# EAGLE schematic Project (EAGLE 9.5.2)
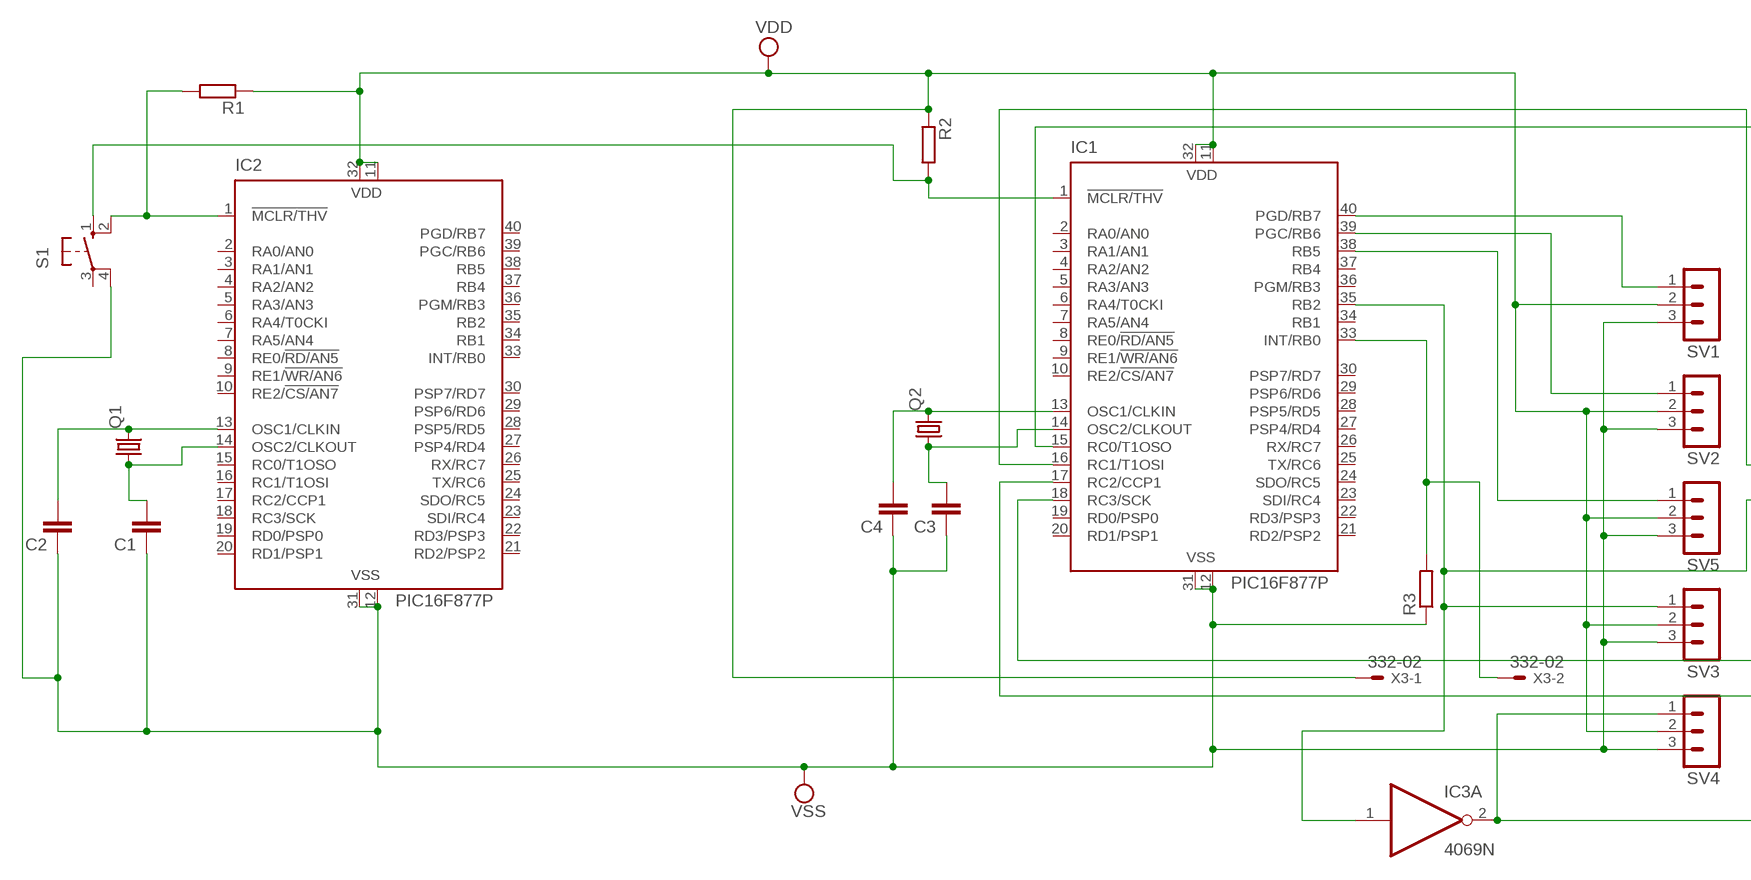
[diagram p0: schematic, sheet 1, part 1 of 2]
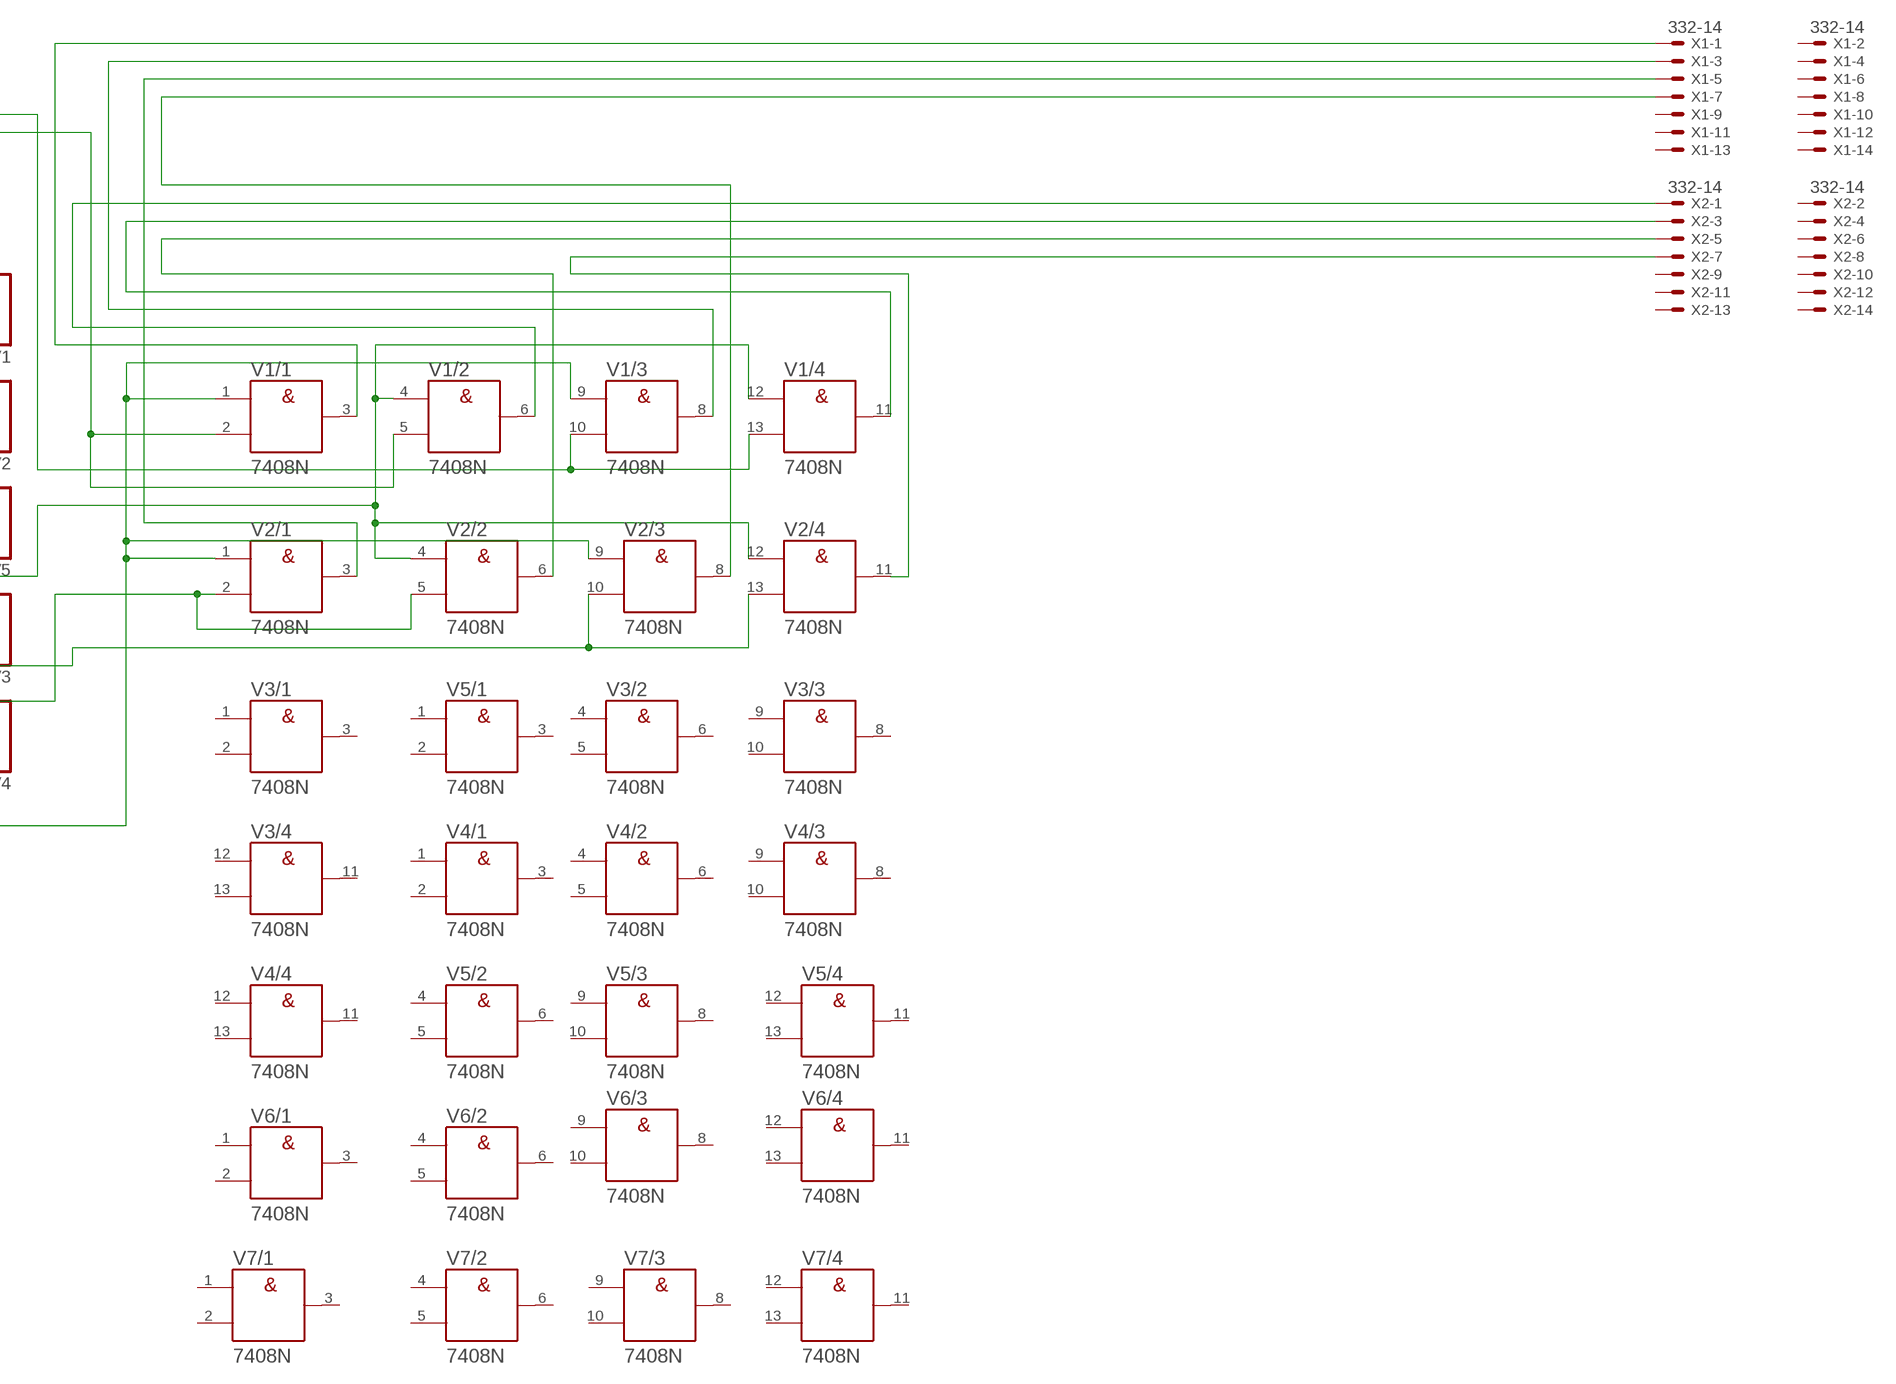
[diagram p1: schematic, sheet 1, part 2 of 2]

## Parts
C1  C7.5/3  [C7.5B3]
C2  C7.5/3  [C7.5B3]
C3  C7.5/3  [C7.5B3]
C4  C7.5/3  [C7.5B3]
IC1  PIC16F877P  [DIL40]
IC2  PIC16F877P  [DIL40]
IC3  4069N  [DIL14]
Q1  CRYSTALHC49U-V  [HC49U-V]
Q2  CRYSTALHC49U-V  [HC49U-V]
R1  R-EU_0207/10  [0207/10]
R2  R-EU_0207/10  [0207/10]
R3  R-EU_0207/10  [0207/10]
S1  10-XX  [B3F-10XX]
SV1  MA03-1  [MA03-1]
SV2  MA03-1  [MA03-1]
SV3  MA03-1  [MA03-1]
SV4  MA03-1  [MA03-1]
SV5  MA03-1  [MA03-1]
V1  7408N  [DIL14]
V2  7408N  [DIL14]
V3  7408N  [DIL14]
V4  7408N  [DIL14]
V5  7408N  [DIL14]
V6  7408N  [DIL14]
V7  7408N  [DIL14]
X1  332-14  [332-14]
X2  332-14  [332-14]
X3  332-02  [332-02]

## Nets
N$1: IC1.33(INT/RB0) R3.2 X3.2
N$2: IC1.35(RB2) IC3.1(A:I) SV3.1 V1.4(/2:A) V1.12(/4:A) V2.4(/2:A) V2.12(/4:A)
N$3: C4.2 IC1.13(OSC1/CLKIN) Q2.2
N$4: C3.2 IC1.14(OSC2/CLKOUT) Q2.1
N$5: C2.2 IC2.13(OSC1/CLKIN) Q1.2
N$6: C1.2 IC2.14(OSC2/CLKOUT) Q1.1
N$7: IC1.1(!MCLR/THV) R2.2 S1.1(S)
N$8: IC2.1(!MCLR/THV) R1.2 S1.2(S1)
N$9: IC1.38(RB5) SV5.1
N$10: IC1.39(PGC/RB6) SV2.1
N$11: IC1.40(PGD/RB7) SV1.1
N$12: IC3.2(A:O) SV4.1 V1.1(/1:A) V1.9(/3:A) V2.1(/1:A) V2.9(/3:A)
N$13: IC1.15(RC0/T1OSO) V1.2(/1:B) V1.5(/2:B)
N$14: V1.8(/3:Y) X1.3
N$15: V1.11(/4:Y) X2.3
N$16: V1.3(/1:Y) X1.1
N$17: V1.6(/2:Y) X2.1
N$18: IC1.16(RC1/T1OSI) V1.10(/3:B) V1.13(/4:B)
N$19: IC1.17(RC2/CCP1) V2.2(/1:B) V2.5(/2:B)
N$21: V2.3(/1:Y) X1.5
N$22: V2.6(/2:Y) X2.5
N$23: IC1.18(RC3/SCK) V2.10(/3:B) V2.13(/4:B)
N$24: V2.8(/3:Y) X1.7
N$25: V2.11(/4:Y) X2.7
VDD: IC1.11(VDD) IC1.32(VDD) IC2.11(VDD) IC2.32(VDD) R1.1 R2.1 SV1.2 SV2.2 SV3.2 SV4.2 SV5.2 X3.1
VSS: C1.1 C2.1 C3.1 C4.1 IC1.12(VSS) IC1.31(VSS) IC2.12(VSS) IC2.31(VSS) R3.1 S1.4(P1) SV1.3 SV2.3 SV3.3 SV4.3 SV5.3
Unconnected: IC1.2(RA0/AN0) IC1.3(RA1/AN1) IC1.4(RA2/AN2) IC1.5(RA3/AN3) IC1.6(RA4/T0CKI) IC1.7(RA5/AN4) IC1.8(RE0/!RD/AN5) IC1.9(RE1/!WR/AN6) IC1.10(RE2/!CS/AN7) IC1.19(RD0/PSP0) IC1.20(RD1/PSP1) IC1.21(RD2/PSP2) IC1.22(RD3/PSP3) IC1.23(SDI/RC4) IC1.24(SDO/RC5) IC1.25(TX/RC6) IC1.26(RX/RC7) IC1.27(PSP4/RD4) IC1.28(PSP5/RD5) IC1.29(PSP6/RD6) IC1.30(PSP7/RD7) IC1.34(RB1) IC1.36(PGM/RB3) IC1.37(RB4) IC2.2(RA0/AN0) IC2.3(RA1/AN1) IC2.4(RA2/AN2) IC2.5(RA3/AN3) IC2.6(RA4/T0CKI) IC2.7(RA5/AN4) IC2.8(RE0/!RD/AN5) IC2.9(RE1/!WR/AN6) IC2.10(RE2/!CS/AN7) IC2.15(RC0/T1OSO) IC2.16(RC1/T1OSI) IC2.17(RC2/CCP1) IC2.18(RC3/SCK) IC2.19(RD0/PSP0) IC2.20(RD1/PSP1) IC2.21(RD2/PSP2) IC2.22(RD3/PSP3) IC2.23(SDI/RC4) IC2.24(SDO/RC5) IC2.25(TX/RC6) IC2.26(RX/RC7) IC2.27(PSP4/RD4) IC2.28(PSP5/RD5) IC2.29(PSP6/RD6) IC2.30(PSP7/RD7) IC2.33(INT/RB0) IC2.34(RB1) IC2.35(RB2) IC2.36(PGM/RB3) IC2.37(RB4) IC2.38(RB5) IC2.39(PGC/RB6) IC2.40(PGD/RB7) IC3.3(B:I) IC3.4(B:O) IC3.5(C:I) IC3.6(C:O) IC3.8(D:O) IC3.9(D:I) IC3.10(E:O) IC3.11(E:I) IC3.12(F:O) IC3.13(F:I) S1.3(P) V3.1(/1:A) V3.2(/1:B) V3.3(/1:Y) V3.4(/2:A) V3.5(/2:B) V3.6(/2:Y) V3.8(/3:Y) V3.9(/3:A) V3.10(/3:B) V3.11(/4:Y) V3.12(/4:A) V3.13(/4:B) V4.1(/1:A) V4.2(/1:B) V4.3(/1:Y) V4.4(/2:A) V4.5(/2:B) V4.6(/2:Y) V4.8(/3:Y) V4.9(/3:A) V4.10(/3:B) V4.11(/4:Y) V4.12(/4:A) V4.13(/4:B) V5.1(/1:A) V5.2(/1:B) V5.3(/1:Y) V5.4(/2:A) V5.5(/2:B) V5.6(/2:Y) V5.8(/3:Y) V5.9(/3:A) V5.10(/3:B) V5.11(/4:Y) V5.12(/4:A) V5.13(/4:B) V6.1(/1:A) V6.2(/1:B) V6.3(/1:Y) V6.4(/2:A) V6.5(/2:B) V6.6(/2:Y) V6.8(/3:Y) V6.9(/3:A) V6.10(/3:B) V6.11(/4:Y) V6.12(/4:A) V6.13(/4:B) V7.1(/1:A) V7.2(/1:B) V7.3(/1:Y) V7.4(/2:A) V7.5(/2:B) V7.6(/2:Y) V7.8(/3:Y) V7.9(/3:A) V7.10(/3:B) V7.11(/4:Y) V7.12(/4:A) V7.13(/4:B) X1.2 X1.4 X1.6 X1.8 X1.9 X1.10 X1.11 X1.12 X1.13 X1.14 X2.2 X2.4 X2.6 X2.8 X2.9 X2.10 X2.11 X2.12 X2.13 X2.14

## Power pins joined to a net without a drawn wire
+UB: V1.14(/+UB:+UB) V2.14(/+UB:+UB) V3.14(/+UB:+UB) V4.14(/+UB:+UB) V5.14(/+UB:+UB) V6.14(/+UB:+UB) V7.14(/+UB:+UB)
-UB: V1.7(/-UB:-UB) V2.7(/-UB:-UB) V3.7(/-UB:-UB) V4.7(/-UB:-UB) V5.7(/-UB:-UB) V6.7(/-UB:-UB) V7.7(/-UB:-UB)
VDD: IC3.14(P:VDD)
VSS: IC3.7(P:VSS)

## Library data of the parts
C1-C4 = capacitor-wima:C: CAPACITOR naming: grid - package width
IC1 IC2 = microchip:PIC16F87*: MICROCONTROLLER; MF: MICROCHIP; MPN: PIC16F877-04/P; OC_FARNELL: 9761349; OC_NEWARK: 61K3463
IC3 = 40xx:4069: Hex INVERTER
Q1 Q2 = crystal:CRYSTAL: CRYSTAL; OC_FARNELL: 1666969; OC_NEWARK: unknown
R1-R3 = rcl:R-EU_: RESISTOR, European symbol; SPICEPREFIX: R
S1 = switch-omron:10-XX: OMRON SWITCH; MPN: B3F-1000; OC_FARNELL: 176432; OC_NEWARK: 36M3542
SV1-SV5 = con-lstb:MA03-1: PIN HEADER; OC_FARNELL: unknown; OC_NEWARK: unknown
V1-V7 = 74ttl-din:74*08: Quad 2-input AND gate
X1 X2 = con-garry:332-14: 14 Pin - 2mm Dual Row Source: www.mpe-connector.de / garry_shortform_2012.pdf
X3 = con-garry:332-02: 2 Pin - 2mm Dual Row Source: www.mpe-connector.de / garry_shortform_2012.pdf